# EasyEDA Pro project ProPrj_MicroUSB_extender_FCB_2024-12-01.epro

# Schematic Schematic1
Board Name: Board1; Create Date: 2024-11-30; Page Name: P1; Project Name: MicroUSB_extender_FCB; Schematic Name: Schematic1; Update Date: 2024-12-01; Company: EasyEDA.com; Drawn: EasyEDA; Page Size: A4; Part Number: JLCPCB-002; Reviewed: EasyEDA; Version: V0.1
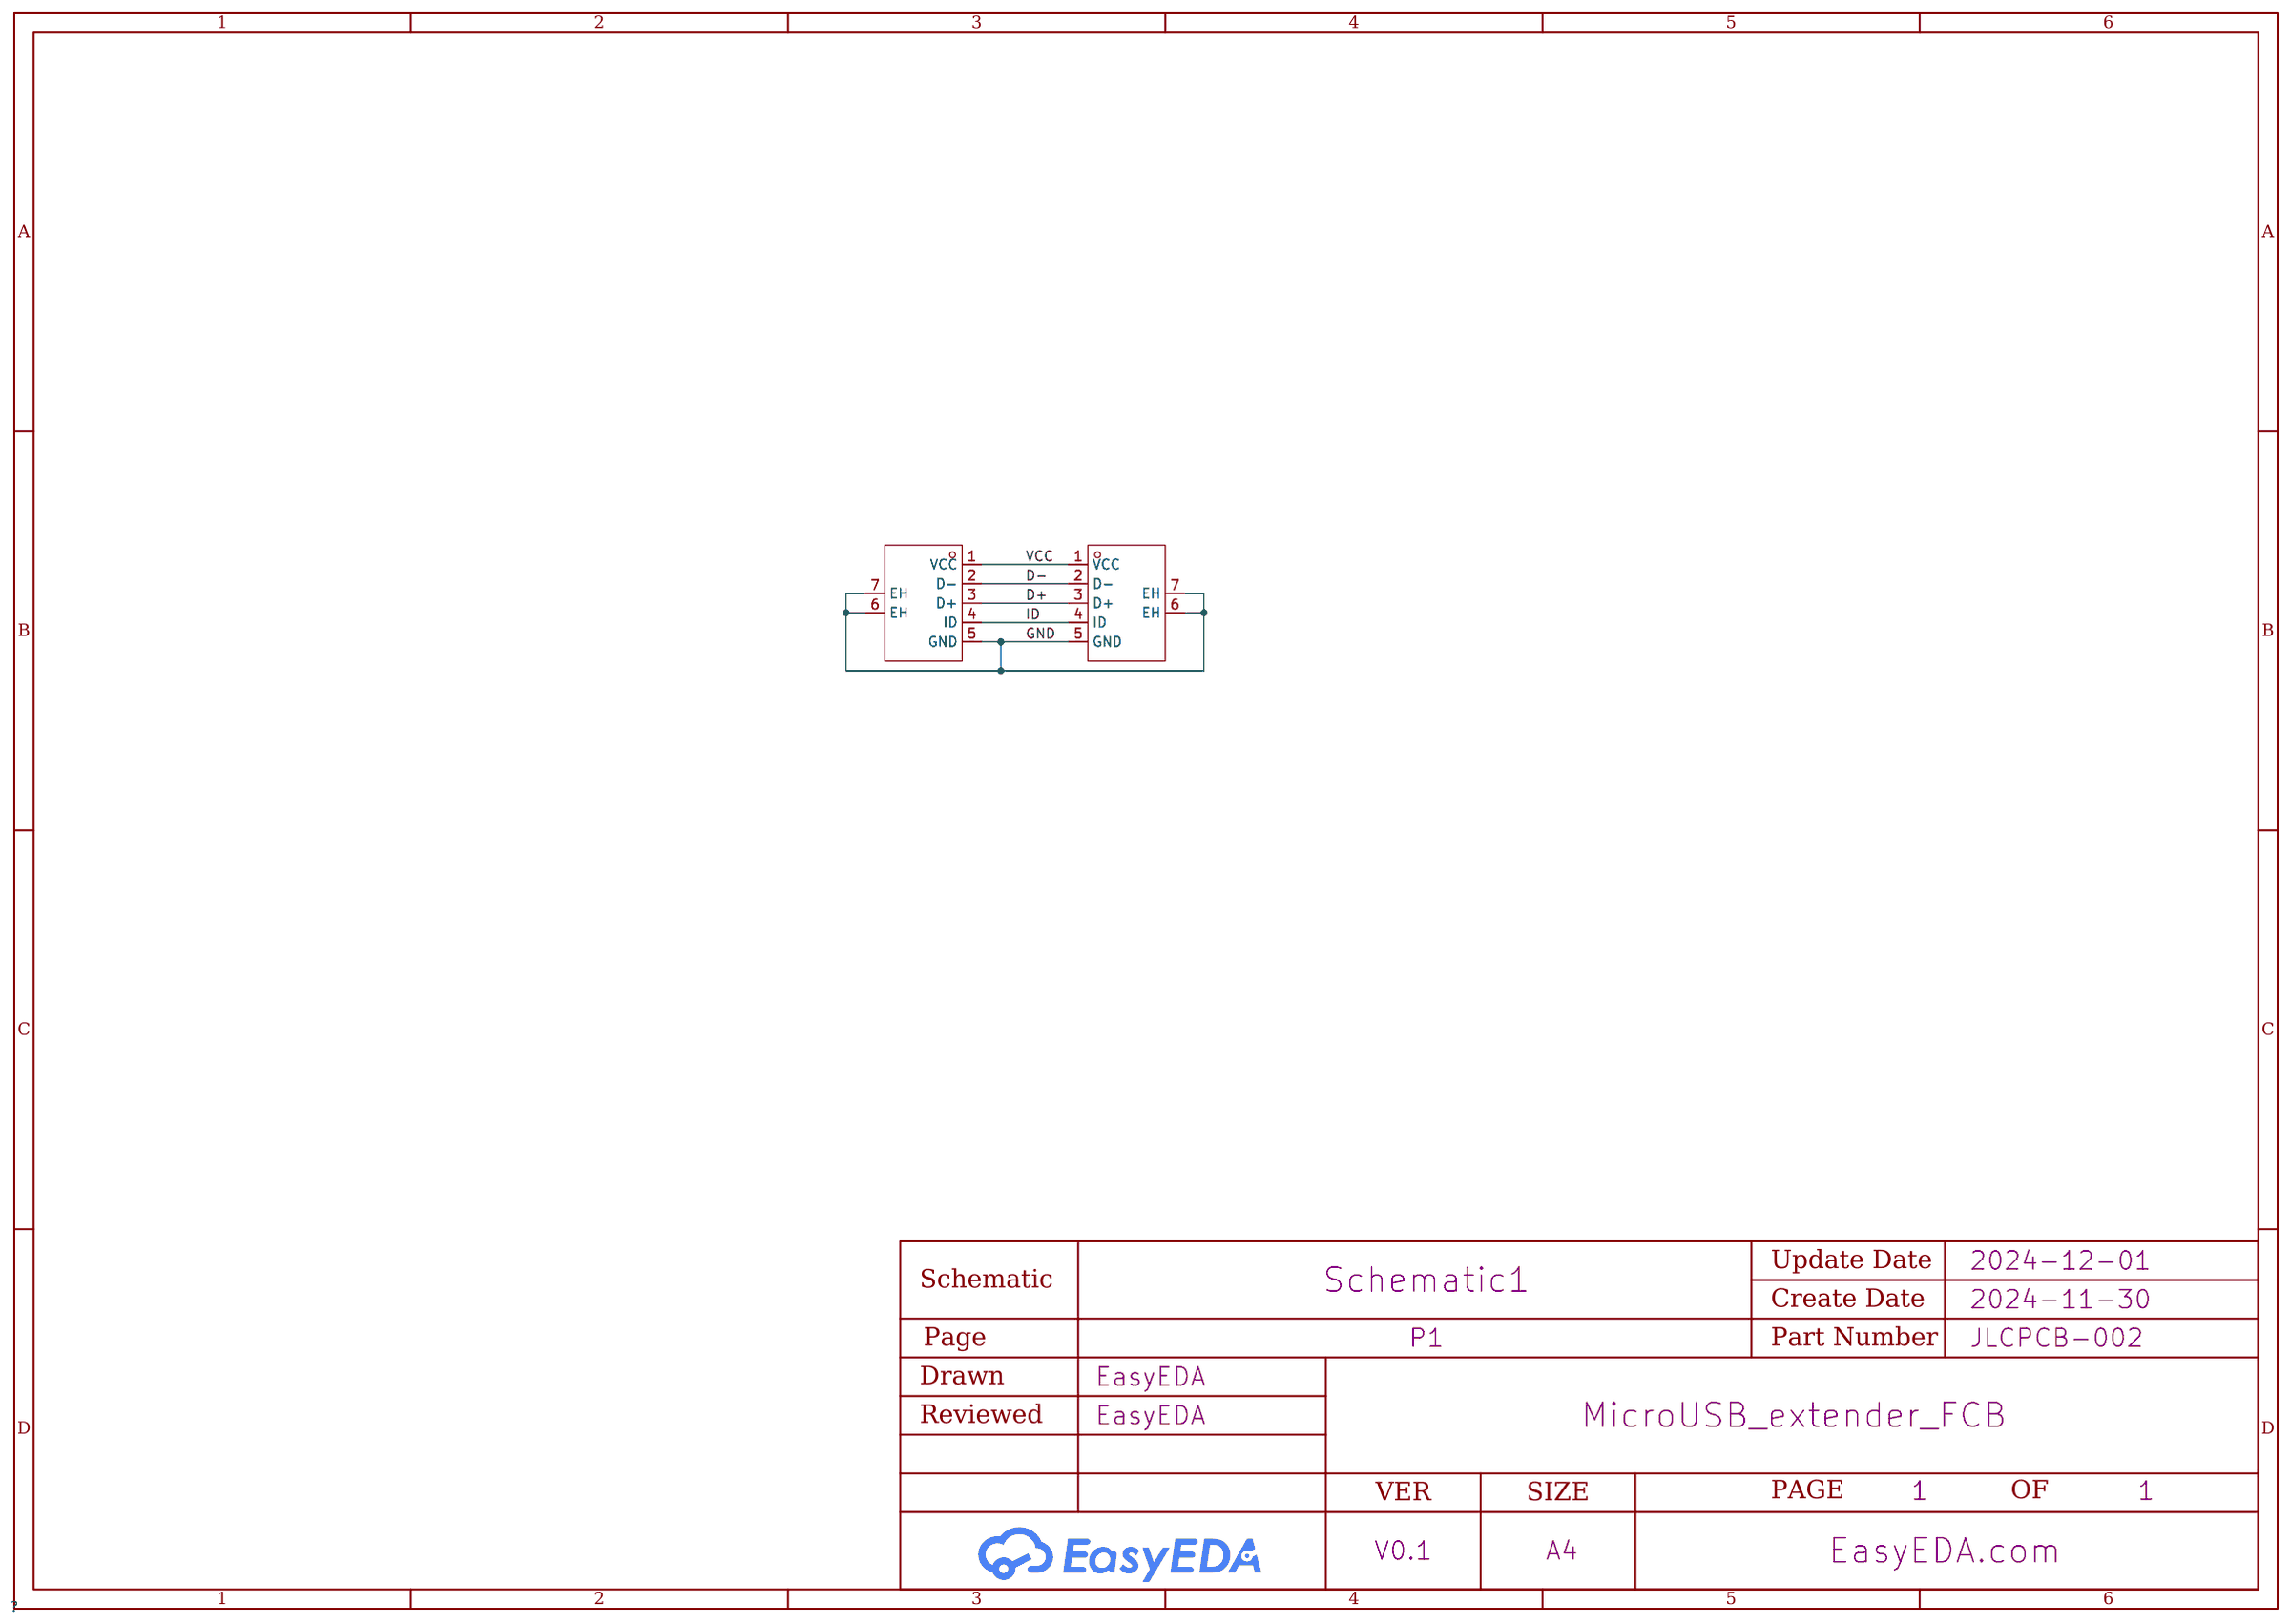
[diagram p0: schematic sheet]

## Parts
USB1  MICRO-ZD-103PWB  [MICRO-USB-SMD_ZD-103PWB]
USB2  MICRO-ZD-103PWB  [MICRO-USB-SMD_ZD-103PWB]

## Library data of the parts
USB1 USB2 = MICRO-ZD-103PWB: Connector Type:Micro-B Standard:USB 2.0 Gender:公 Number of Ports:1 Number of Contacts:5P Mounting Style:- Current Rating - Power (Max):- Contact Material:- Contact Plating:- Operating Temperature Range:- Operating Temperature Range:- Soldering Temperature; Supplier Part: C5295970; Manufacturer: HDGC(华德共创); Supplier Footprint: SMD; JLCPCB Part Class: Extended Part; Datasheet: https://atta.szlcsc.com/upload/public/pdf/source/20230823/560E005481561DB5EA274167A2775CD5.pdf; Supplier: LCSC; Connector Type: Micro-B; Standard: USB 2.0; Gender: 公; Number of Ports: 1; Number of Contacts: 5P

## Nets
GND: USB1.5(GND) USB1.6(EH) USB1.7(EH) USB2.5(GND) USB2.6(EH) USB2.7(EH)
VCC: USB1.1(VCC) USB2.1(VCC)
D+: USB1.3(D+) USB2.3(D+)
D-: USB1.2(D-) USB2.2(D-)
ID: USB1.4(ID) USB2.4(ID)

# Board PCB1
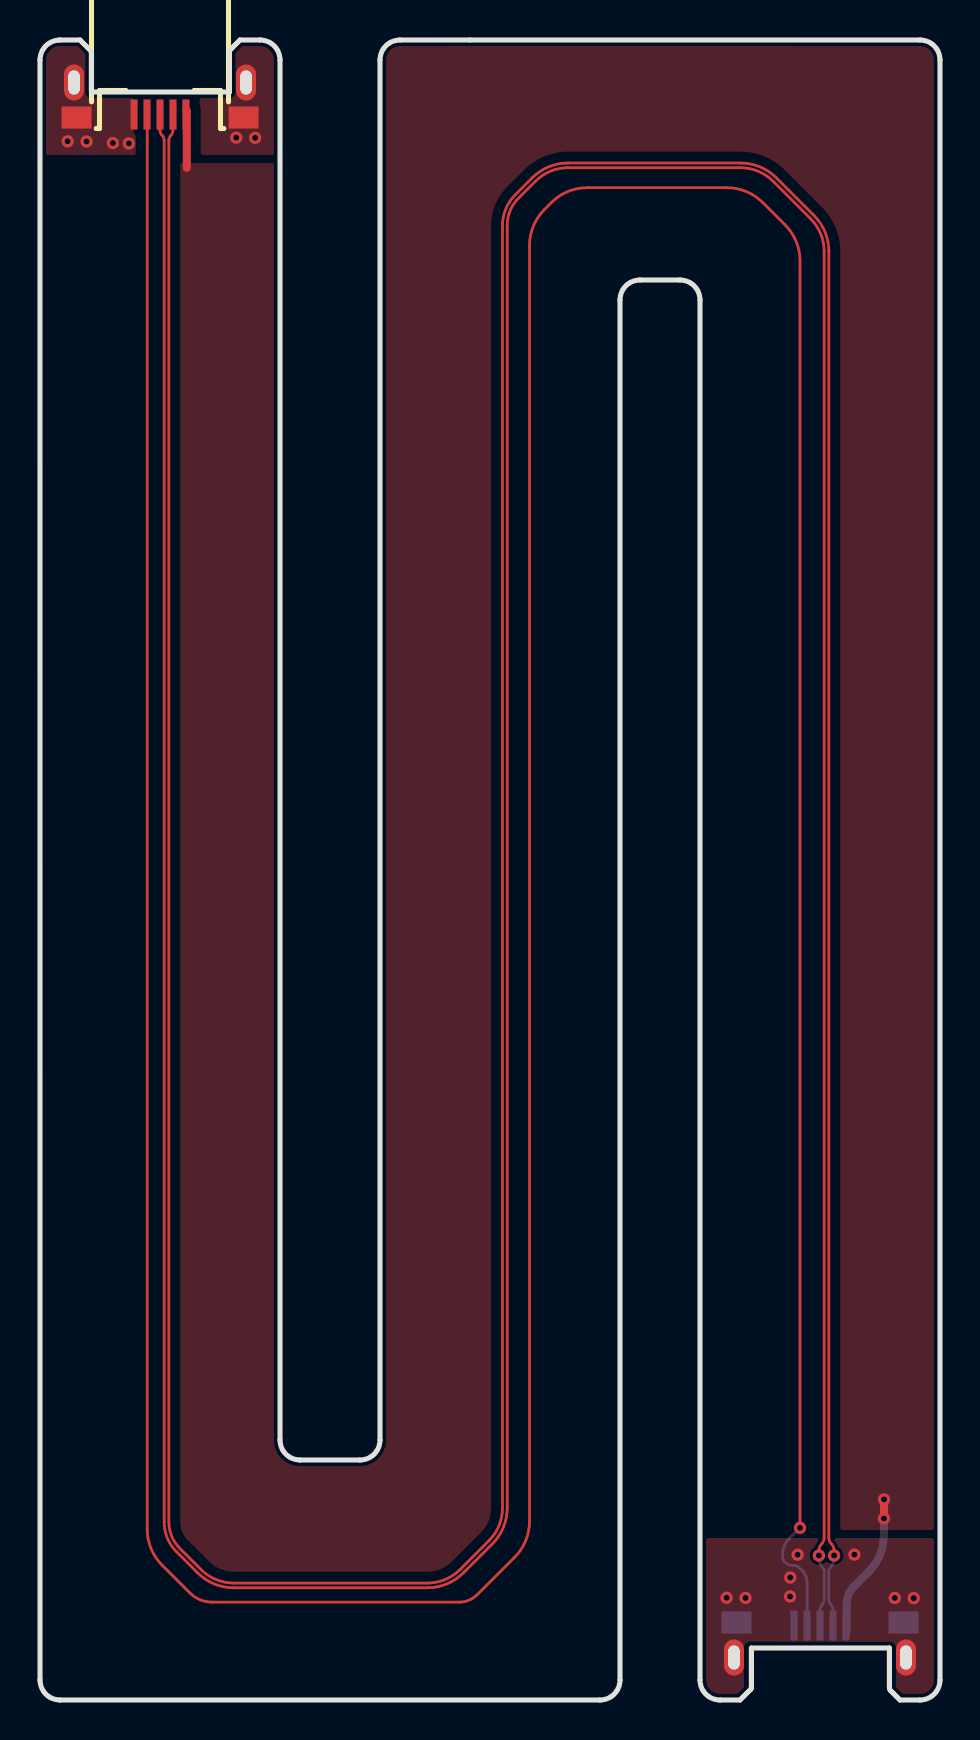
[diagram p1: board, top side]
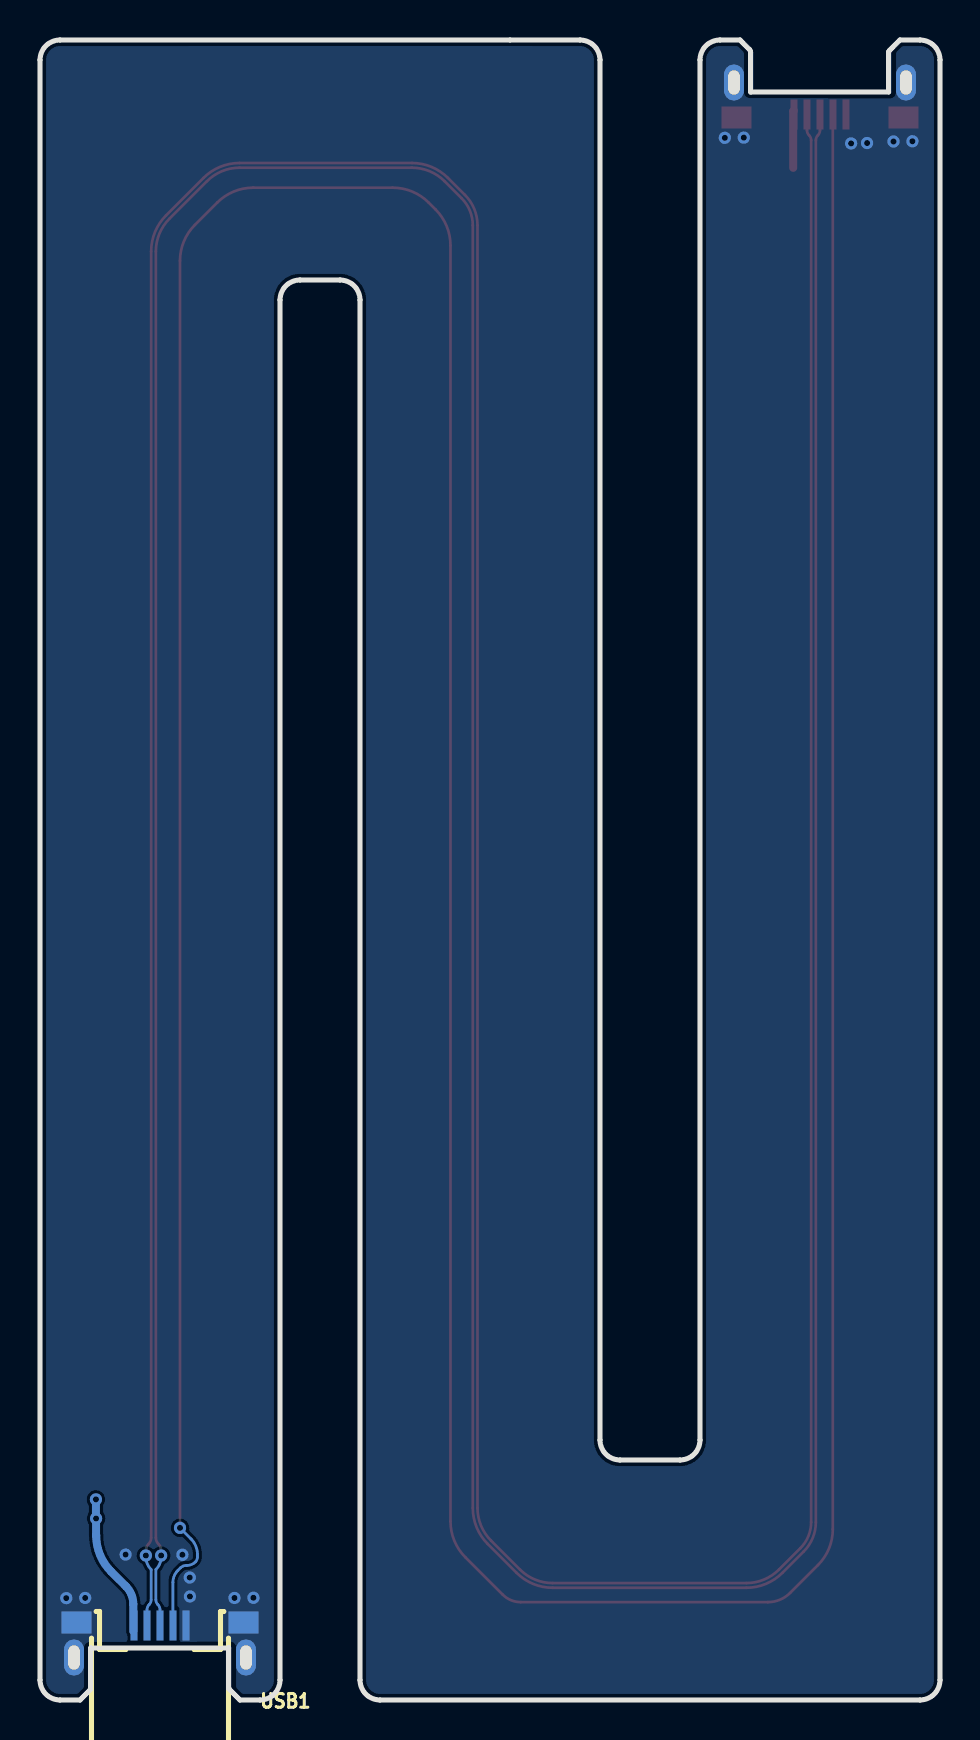
[diagram p2: board, bottom side, seen from below]

Outline 45 x 83 mm; copper layers: Top Layer, Bottom Layer. Coordinates in mm from the lower left corner of the outline.
Outline path: 2.57,82.39 arc(2.56,82.43) 2.54,82.46 2,83 1,83 arc(0.29,82.71) 0,82 0,1 arc(0.29,0.29) 1,0 28,0 arc(28.71,0.29) 29,1 29,70 arc(29.3,70.71) 30,71 32,71 arc(32.71,70.71) 33,70 33,1 arc(33.29,0.29) 34,0 35,0 35.54,0.54 arc(35.56,0.57) 35.57,0.62 ; 9.47,82.4 arc(9.48,82.46) 9.52,82.52 10,83 11,83 arc(11.71,82.71) 12,82 12,13 arc(12.29,12.29) 13,12 16,12 arc(16.71,12.29) 17,13 17,82 arc(17.3,82.71) 18,83 44,83 arc(44.71,82.71) 45,82 45,1 arc(44.71,0.29) 44,0 43,0 42.52,0.48 arc(42.48,0.54) 42.47,0.6
Stack: Top Layer 0.012mm / Dielectric2 0.066mm PI er 4.5 / Bottom Layer 0.012mm

## Design rules (mm)
net D-: DP1
net D+: DP1
template: Custom Config
spacing copperThickness1oz (default): track to track 0.102, other pairs 0.152 to 0.3
spacing copperThickness2oz: track to track 0.203, other pairs 0.152 to 0.3
track width copperThickness1oz (default): min 0.127, default 0.254, max 2.54
track width copperThickness2oz: min 0.203, default 0.254, max 2.54
differential pair differentialPair: width min 0.127, default 0.254, max 2.54; gap min 0.152, default 0.1
differential pair USB2_0 (default): width min 0.135, default 0.135, max 0.135; gap min 0.1, default 0.1
via viaSize (default): diameter min 0.5, default 0.61, max 10; hole min 0.3, default 0.305, max 6.3
net GND uses copperRegion1
pour e5 uses VCC
pour e953 uses VCC

## Placement (name value [footprint] x y rotation side)
USB1  MICRO-ZD-103PWB  [MICRO-USB-SMD_ZD-103PWB]  39 3 0 bottom
USB2  MICRO-ZD-103PWB  [MICRO-USB-SMD_ZD-103PWB]  6 80 0 top

## Footprints (pads in the part's own frame, mm; a bottom-side part is the same pattern mirrored in y, then rotated)
MICRO-USB-SMD_ZD-103PWB
  rect 0.35x1.5 smd: 1(1.3,-0.725) 2(0.65,-0.725) 3(0,-0.725) 4(-0.65,-0.725) 5(-1.3,-0.725)
  oval 1x1.8 hole 0.6x1.2: 6(-4.3,0.875) 6(4.3,0.875)
  rect 1.5x1.1 smd: 7(-4.175,-0.875) 7(4.175,-0.875)

## Nets
As in the schematic.

## Via types
v1: diameter 0.61, hole 0.305, Top Layer to Bottom Layer, 19 vias

## Routing (per net, layer and track width the routed paths; a pad name or vN(x,y) marks a point on that pad's centre or on a via; arc(x,y) is an arc through that point)
GND:
  vias: v1(1.38,77.94) v1(2.33,77.93) v1(3.65,77.85) v1(4.45,77.83) v1(9.81,78.12) v1(10.76,78.11) v1(34.33,5.11) v1(35.28,5.1) v1(37.51,6.12) v1(37.51,5.18) v1(37.88,7.26) v1(40.72,7.27) v1(42.74,5.1) v1(43.69,5.09)
VCC: length 11
  Top Layer w0.4: 7.31,79.47 7.34,79.44 7.34,76.61 ; v1(42.2,9.07) 42.21,9.08 v1(42.21,10.03)
  Bottom Layer w0.4: v1(42.21,10.03) 42.21,9.08 v1(42.2,9.07) 42.2,8.23 42.19,8.22 arc(42,7.25) 41.45,6.43 40.71,5.69 arc(40.43,5.27) 40.34,4.79 40.34,3.44
D+: length 244.2
  Top Layer w0.135: v1(38.95,7.22) 38.95,7.48 arc(38.98,7.65) 39.08,7.8 arc(39.17,7.94) 39.21,8.11 39.21,72.43 arc(39.03,73.31) 38.53,74.06 36.66,75.94 arc(35.91,76.44) 35.03,76.61 26.4,76.61 arc(25.52,76.44) 24.77,75.94 23.92,75.09 arc(23.51,74.47) 23.36,73.73 23.36,9.6 arc(23.17,8.63) 22.62,7.81 21.17,6.36 arc(20.34,5.8) 19.37,5.61 9.68,5.61 arc(8.71,5.8) 7.88,6.36 6.82,7.42 arc(6.37,8.1) 6.21,8.89 6.21,77.99 arc(6.18,78.12) 6.11,78.24 arc(6.03,78.35) 6,78.49 6,79.47
  Bottom Layer w0.135: 39,3.53 39,4.51 arc(39.03,4.65) 39.11,4.76 arc(39.18,4.88) 39.21,5.01 39.21,6.52 arc(39.01,6.81) 38.95,7.16 v1(38.95,7.22)
D-: length 244.2
  Top Layer w0.135: v1(39.71,7.22) 39.71,7.48 arc(39.67,7.65) 39.58,7.8 arc(39.48,7.94) 39.44,8.11 39.44,72.43 arc(39.25,73.4) 38.7,74.23 36.82,76.11 arc(36,76.66) 35.03,76.85 26.4,76.85 arc(25.43,76.66) 24.61,76.11 23.76,75.26 arc(23.29,74.56) 23.13,73.73 23.13,9.6 arc(22.95,8.72) 22.45,7.97 21,6.52 arc(20.25,6.02) 19.37,5.85 9.68,5.85 arc(8.8,6.02) 8.05,6.52 6.98,7.59 arc(6.58,8.19) 6.44,8.89 6.44,77.99 arc(6.47,78.12) 6.55,78.24 arc(6.62,78.35) 6.65,78.49 6.65,79.47
  Bottom Layer w0.135: v1(39.71,7.22) 39.71,7.16 arc(39.64,6.81) 39.44,6.52 39.44,5.01 arc(39.47,4.88) 39.55,4.76 arc(39.62,4.65) 39.65,4.51 39.65,3.53
ID: length 244.2
  Top Layer w0.135: 5.36,79.34 5.36,8.54 arc(5.55,7.57) 6.1,6.74 7.49,5.35 arc(8.01,5.01) 8.61,4.89 20.96,4.89 arc(21.45,4.99) 21.86,5.27 23.73,7.14 arc(24.28,7.96) 24.48,8.93 24.48,72.73 arc(24.67,73.7) 25.22,74.52 25.57,74.87 arc(26.39,75.42) 27.37,75.62 34.34,75.62 arc(35.32,75.42) 36.14,74.87 37.26,73.75 arc(37.81,72.93) 38,71.96 v1(38,8.61)
  Bottom Layer w0.135: 38.36,3.53 38.36,5.88 arc(38.29,6.2) 38.11,6.48 37.98,6.6 arc(37.84,6.7) 37.68,6.73 37.64,6.73 arc(37.42,6.77) 37.24,6.9 arc(37.16,7.02) 37.13,7.16 37.13,7.28 arc(37.21,7.7) 37.45,8.06 v1(38,8.61)

## Copper pours and planes (outline as drawn; the poured copper is in the pictures)
GND on Top Layer: 0,83 12,83 12,77.35 0,77.35
GND on Top Layer: 33,8 45,8 45,0 33,0
GND on Bottom Layer: 0,83 44.92,83 44.92,-0.28 0,-0.28
VCC on Top Layer: 0.02,83.04 45.02,83.04 45.02,4.87 0.02,4.87

## Text on the board
Document Layer: Layer | Top Silkscreen Layer | Top Paste Mask Layer | Top Solder Mask Layer | Top Layer | Dielectric2 | Bottom Layer | Bottom Solder Mask Layer | Bottom Paste Mask Layer | Bottom Silkscreen Layer | Type | TOP_SILK | TOP_PASTE_MASK | TOP_SOLDER_MASK | TOP | SUBSTRATE | BOTTOM | BOT_SOLDER_MASK | BOT_PASTE_MASK | BOT_SILK | Material | PI | Thickness(mm) | 0 | 0.01 | 0.012 | 0.066 | Permittivity | 3.3 | 4.5 | Loss Tangent | 0.02
